# Altium schematic sheet 压力传感器2.SchDoc
size A4; SheetNumber: 6; SheetTotal: 8
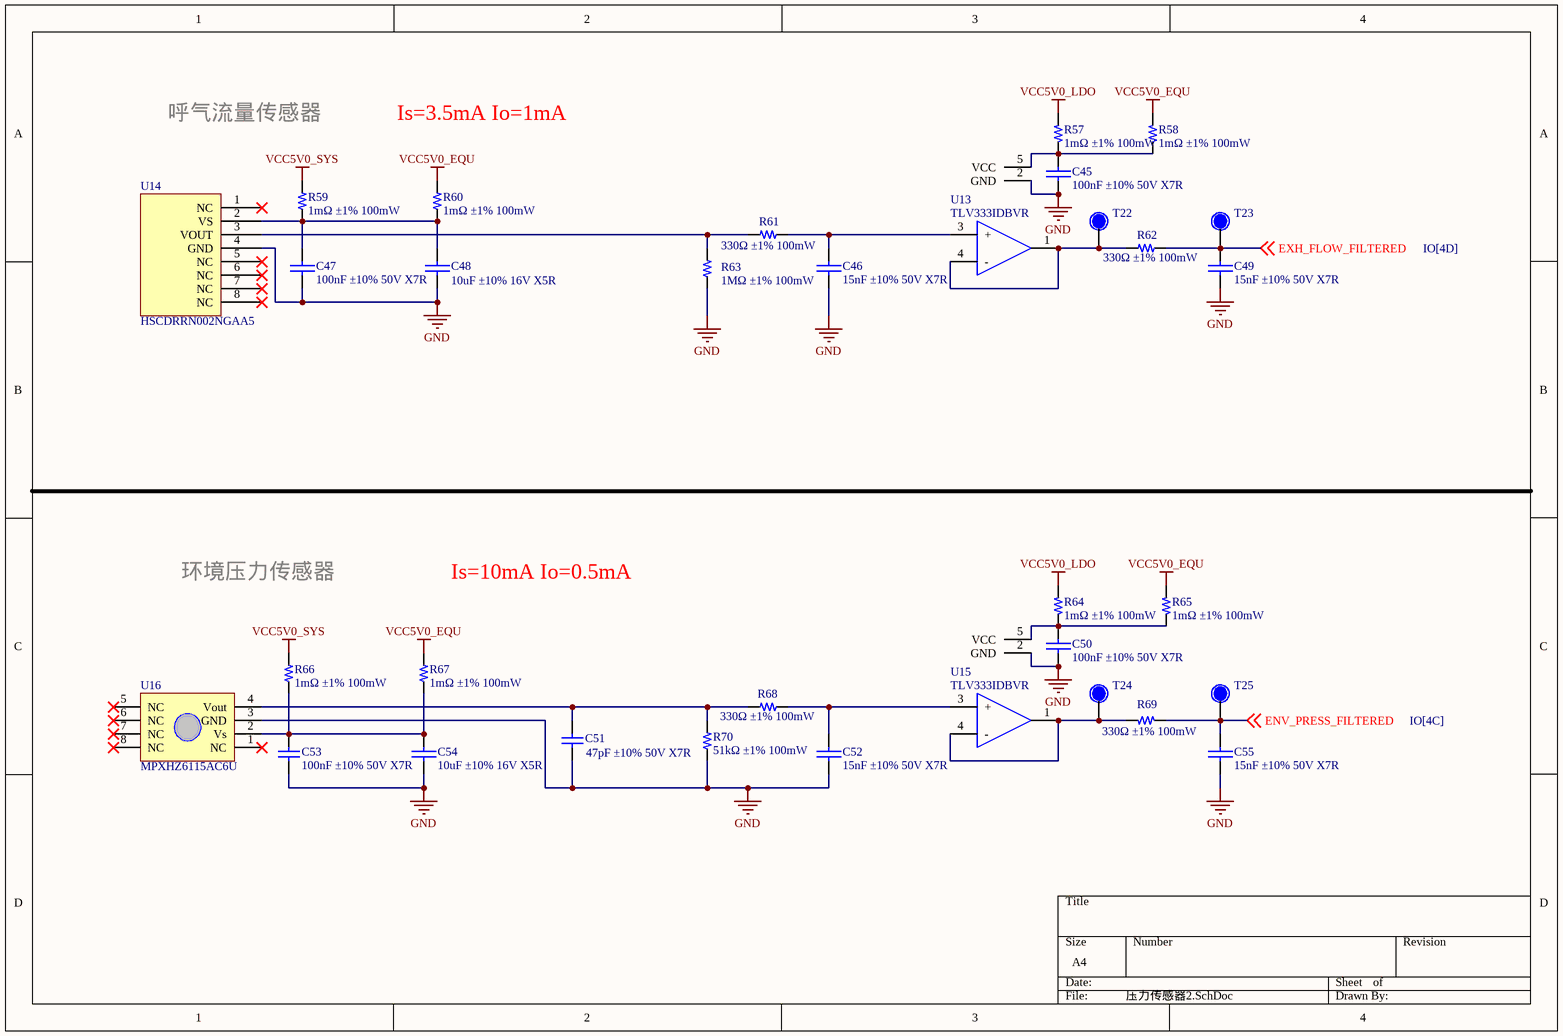
[diagram p0: 压力传感器2.SchDoc]

## Parts
C45  100nF ±10% 50V X7R  [C-0603]
C46  15nF ±10% 50V X7R  [C-0603]
C47  100nF ±10% 50V X7R  [C-0603]
C48  10uF ±10% 16V X5R  [C-0805]
C49  15nF ±10% 50V X7R  [C-0603]
C50  100nF ±10% 50V X7R  [C-0603]
C51  47pF ±10% 50V X7R  [C-0603]
C52  15nF ±10% 50V X7R  [C-0603]
C53  100nF ±10% 50V X7R  [C-0603]
C54  10uF ±10% 16V X5R  [C-0805]
C55  15nF ±10% 50V X7R  [C-0603]
R57  1mΩ ±1% 100mW  [R-0603]
R58  1mΩ ±1% 100mW  [R-0603]
R59  1mΩ ±1% 100mW  [R-0603]
R60  1mΩ ±1% 100mW  [R-0603]
R61  330Ω ±1% 100mW  [R-0603]
R62  330Ω ±1% 100mW  [R-0603]
R63  1MΩ ±1% 100mW  [R-0603]
R64  1mΩ ±1% 100mW  [R-0603]
R65  1mΩ ±1% 100mW  [R-0603]
R66  1mΩ ±1% 100mW  [R-0603]
R67  1mΩ ±1% 100mW  [R-0603]
R68  330Ω ±1% 100mW  [R-0603]
R69  330Ω ±1% 100mW  [R-0603]
R70  51kΩ ±1% 100mW  [R-0603]
T22  Test?  [TestPad_SMD]  (value not drawn)
T23  Test?  [TestPad_SMD]  (value not drawn)
T24  Test?  [TestPad_SMD]  (value not drawn)
T25  Test?  [TestPad_SMD]  (value not drawn)
U13  TLV333IDBVR  [SOT23-5]
U14  HSCDRRN002NGAA5  [SSCDRR]
U15  TLV333IDBVR  [SOT23-5]
U16  MPXHZ6115AC6U  [1317]

## Nets
GND: C45.1 C46.1 C47.1 C48.1 C49.1 C50.2 C51.1 C52.1 C53.2 C54.2 C55.1 R63.2 R70.1(TOP) U13.2(GND) U14.4(GND) U15.2(GND) U16.3(GND)
VCC5V0_EQU: R58.2(BOT) R60.1 R65.2(BOT) R67.1
VCC5V0_LDO: R57.2(BOT) R64.2(BOT)
VCC5V0_SYS: R59.1 R66.1
ENV_PRESS_FILTERED: C55.2 R69.1(TOP) T25.1 ; off-sheet ENV_PRESS_FILTERED
EXH_FLOW_FILTERED: C49.2 R62.1 T23.1 ; off-sheet EXH_FLOW_FILTERED
NetC45_2: C45.2 R57.1(TOP) R58.1(TOP) U13.5(VCC)
NetC46_2: C46.2 R61.1 U13.3(+)
NetC47_2: C47.2 C48.2 R59.2 R60.2 U14.2(VS)
NetC50_1: C50.1 R64.1(TOP) R65.1(TOP) U15.5(VCC)
NetC51_2: C51.2 R68.2 R70.2(BOT) U16.4(Vout)
NetC52_2: C52.2 R68.1 U15.3(+)
NetC53_1: C53.1 C54.1 R66.2 R67.2 U16.2(Vs)
NetR61_2: R61.2 R63.1 U14.3(VOUT)
NetR62_2: R62.2 T22.1 U13.1 U13.4(-)
NetR69_2: R69.2(BOT) T24.1 U15.1 U15.4(-)

Not connected (* = marked no-connect by the designer): U14 1(NC)* 5(NC)* 6(NC)* 7(NC)* 8(NC)*; U16 1(NC)* 5(NC)* 6(NC)* 7(NC)* 8(NC)*

## Notes on the sheet
- 呼气流量传感器
- Is=3.5mA Io=1mA
- 环境压力传感器
- Is=10mA Io=0.5mA

## Library data of the parts
C45 C47 C50 = CAP
C46 C48 C49 C52 C54 C55 = CAP: Capacitor
C51 = 100nF_1: 贴片瓷介电容100nF±5%,0805; 物料编号: 210001894; 详细描述: X7R,50V,三星CL21B104JBCNNNC; 版本: V1.00; 制造商: 三星; 名称: 贴片瓷介电容100nF±5%,0805
C53 = 100nF_1: 物料编号: 210001894; 详细描述: X7R,50V,三星CL21B104JBCNNNC; 版本: V1.00; 名称: 贴片瓷介电容100nF±5%,0805; 制造商: 三星
R57 R58 R64 R65 = 10K_1: 国巨 / 1mΩ ±1% 100mW; 版本: V1.00; 名称: 贴片电阻10K±1%; 物料编号: 210001830; 详细描述: 0805,1/8W,国巨RC0805FR-0710K; 制造商: 国巨
R59 R60 R66 R67 = R-0603: 国巨 / 1mΩ ±1% 100mW
R61-R63 R68 = R-0603
R69 = 100Ω_1: 国巨RC0805FR-07100R; 物料编号: 210000765; 详细描述: 0805,1/8W,国巨RC0805FR-07100R; 制造商: 国巨; 版本: V1.00; 名称: 贴片电阻100±1%
R70 = 10K_1: 国巨RC0805FR-0710K; 版本: V1.00; 名称: 贴片电阻10K±1%; 物料编号: 210001830; 详细描述: 0805,1/8W,国巨RC0805FR-0710K; 制造商: 国巨
T22-T25 = TestPad_SMD
U13 U15 = TLV333IDBVR: 品牌：TI，型号：TLV333IDBVR,SOIC-8,–25°~+85°C,单运放，ROHS
U14 = SSCMJJ010KDAA5
U16 = MPXHZ6115AC6U: 名称: 芯片MPXHZ6115AC6U; 版本: V1.00; 物料编号: APPLY; 制造商: freescale; 详细描述: 贴片大气压传感器，1.5%最大误差。